# Altium schematic sheet ZYNQ_SOC_PWR.SchDoc
size A4
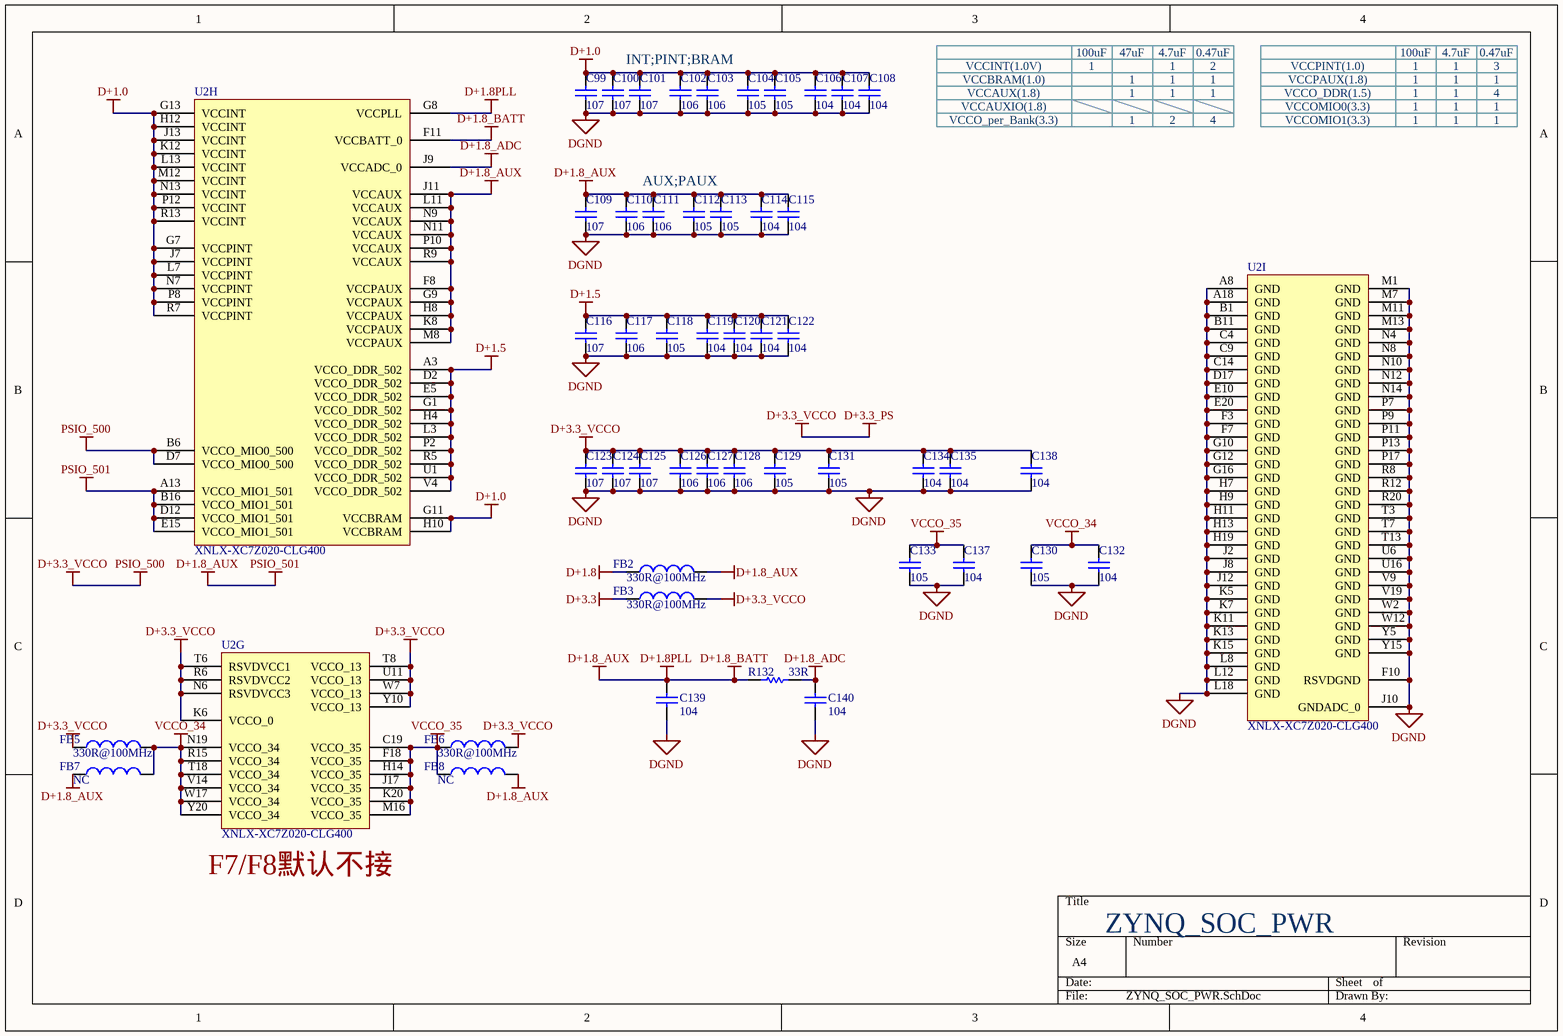
[diagram p0: ZYNQ_SOC_PWR.SchDoc]

## Parts
C99  107  [C 1206_L]
C100  107  [C 1206_L]
C101  107  [C 1206_L]
C102  106  [C 0603_L]
C103  106  [C 0603_L]
C104  105  [C 0402_LL]
C105  105  [C 0402_LL]
C106  104  [C 0402_LL]
C107  104  [C 0402_LL]
C108  104  [C 0402_LL]
C109  107  [C 1206_L]
C110  106  [C 0603_L]
C111  106  [C 0603_L]
C112  105  [C 0402_LL]
C113  105  [C 0402_LL]
C114  104  [C 0402_LL]
C115  104  [C 0402_LL]
C116  107  [C 1206_L]
C117  106  [C 0603_L]
C118  105  [C 0402_LL]
C119  104  [C 0402_LL]
C120  104  [C 0402_LL]
C121  104  [C 0402_LL]
C122  104  [C 0402_LL]
C123  107  [C 1206_L]
C124  107  [C 1206_L]
C125  107  [C 1206_L]
C126  106  [C 0603_L]
C127  106  [C 0603_L]
C128  106  [C 0603_L]
C129  105  [C 0402_LL]
C130  105  [C 0402_LL]
C131  105  [C 0402_LL]
C132  104  [C 0402_LL]
C133  105  [C 0402_LL]
C134  104  [C 0402_LL]
C135  104  [C 0402_LL]
C137  104  [C 0402_LL]
C138  104  [C 0402_LL]
C139  104  [C 0402_LL]
C140  104  [C 0402_LL]
FB2  value 330R@100MHz  [L 0805]  (hidden comment: Ferrite Bead)
FB3  value 330R@100MHz  [L 0805]  (hidden comment: Ferrite Bead)
FB5  value 330R@100MHz  [L 0805]  (hidden comment: Ferrite Bead)
FB6  value 330R@100MHz  [L 0805]  (hidden comment: Ferrite Bead)
FB7  value NC  [L 0805]  (hidden comment: Ferrite Bead)
FB8  value NC  [L 0805]  (hidden comment: Ferrite Bead)
R132  33R  [R 0402_L]
U2  XNLX-XC7Z020-CLG400  [BGA400]  (parts G,H,I of 9)

## Nets
D+1.0: C99.2 C100.2 C101.2 C102.2 C103.2 C104.2 C105.2 C106.2 C107.2 C108.2 U2.G7(VCCPINT) U2.G11(VCCBRAM) U2.G13(VCCINT) U2.H10(VCCBRAM) U2.H12(VCCINT) U2.J7(VCCPINT) U2.J13(VCCINT) U2.K12(VCCINT) U2.L7(VCCPINT) U2.L13(VCCINT) U2.M12(VCCINT) U2.N7(VCCPINT) U2.N13(VCCINT) U2.P8(VCCPINT) U2.P12(VCCINT) U2.R7(VCCPINT) U2.R13(VCCINT)
D+1.5: C116.2 C117.2 C118.2 C119.2 C120.2 C121.2 C122.2 U2.A3(VCCO_DDR_502) U2.D2(VCCO_DDR_502) U2.E5(VCCO_DDR_502) U2.G1(VCCO_DDR_502) U2.H4(VCCO_DDR_502) U2.L3(VCCO_DDR_502) U2.P2(VCCO_DDR_502) U2.R5(VCCO_DDR_502) U2.U1(VCCO_DDR_502) U2.V4(VCCO_DDR_502)
D+1.8: FB2.1
D+1.8_ADC: C140.2 R132.1 U2.J9(VCCADC_0)
D+1.8_AUX: C109.2 C110.2 C111.2 C112.2 C113.2 C114.2 C115.2 C139.2 FB2.2 FB7.1 FB8.2 R132.2 U2.A13(VCCO_MIO1_501) U2.B16(VCCO_MIO1_501) U2.D12(VCCO_MIO1_501) U2.E15(VCCO_MIO1_501) U2.F8(VCCPAUX) U2.F11(VCCBATT_0) U2.G8(VCCPLL) U2.G9(VCCPAUX) U2.H8(VCCPAUX) U2.J11(VCCAUX) U2.K8(VCCPAUX) U2.L11(VCCAUX) U2.M8(VCCPAUX) U2.N9(VCCAUX) U2.N11(VCCAUX) U2.P10(VCCAUX) U2.R9(VCCAUX)  [also labelled D+1.8_BATT, D+1.8PLL, PSIO_501]
D+3.3: FB3.1
D+3.3_PS: C123.2 C124.2 C125.2 C126.2 C127.2 C128.2 C129.2 C131.2 C134.2 C135.2 C138.2 FB3.2 FB5.1 FB6.2 U2.B6(VCCO_MIO0_500) U2.D7(VCCO_MIO0_500) U2.K6(VCCO_0) U2.N6(RSVDVCC3) U2.R6(RSVDVCC2) U2.T6(RSVDVCC1) U2.T8(VCCO_13) U2.U11(VCCO_13) U2.W7(VCCO_13) U2.Y10(VCCO_13)  [also labelled D+3.3_VCCO, PSIO_500]
DGND: C99.1 C100.1 C101.1 C102.1 C103.1 C104.1 C105.1 C106.1 C107.1 C108.1 C109.1 C110.1 C111.1 C112.1 C113.1 C114.1 C115.1 C116.1 C117.1 C118.1 C119.1 C120.1 C121.1 C122.1 C123.1 C124.1 C125.1 C126.1 C127.1 C128.1 C129.1 C130.1 C131.1 C132.1 C133.1 C134.1 C135.1 C137.1 C138.1 C139.1 C140.1 U2.A8(GND) U2.A18(GND) U2.B1(GND) U2.B11(GND) U2.C4(GND) U2.C9(GND) U2.C14(GND) U2.D17(GND) U2.E10(GND) U2.E20(GND) U2.F3(GND) U2.F7(GND) U2.F10(RSVDGND) U2.G10(GND) U2.G12(GND) U2.G16(GND) U2.H7(GND) U2.H9(GND) U2.H11(GND) U2.H13(GND) U2.H19(GND) U2.J2(GND) U2.J8(GND) U2.J10(GNDADC_0) U2.J12(GND) U2.K5(GND) U2.K7(GND) U2.K11(GND) U2.K13(GND) U2.K15(GND) U2.L8(GND) U2.L12(GND) U2.L18(GND) U2.M1(GND) U2.M7(GND) U2.M11(GND) U2.M13(GND) U2.N4(GND) U2.N8(GND) U2.N10(GND) U2.N12(GND) U2.N14(GND) U2.P7(GND) U2.P9(GND) U2.P11(GND) U2.P13(GND) U2.P17(GND) U2.R8(GND) U2.R12(GND) U2.R20(GND) U2.T3(GND) U2.T7(GND) U2.T13(GND) U2.U6(GND) U2.U16(GND) U2.V9(GND) U2.V19(GND) U2.W2(GND) U2.W12(GND) U2.Y5(GND) U2.Y15(GND)
VCCO_34: C130.2 C132.2 FB5.2 FB7.2 U2.N19(VCCO_34) U2.R15(VCCO_34) U2.T18(VCCO_34) U2.V14(VCCO_34) U2.W17(VCCO_34) U2.Y20(VCCO_34)
VCCO_35: C133.2 C137.2 FB6.1 FB8.1 U2.C19(VCCO_35) U2.F18(VCCO_35) U2.H14(VCCO_35) U2.J17(VCCO_35) U2.K20(VCCO_35) U2.M16(VCCO_35)

## Notes on the sheet
- INT;PINT;BRAM
- VCCINT(1.0V)
- VCCBRAM(1.0)
- VCCAUX(1.8)
- VCCAUXIO(1.8)
- VCCO_per_Bank(3.3)
- 100uF
- 1
- 47uF
- 4.7uF
- 2
- 0.47uF
- 4
- VCCPINT(1.0)
- VCCO_DDR(1.5)
- VCCPAUX(1.8)
- VCCOMIO0(3.3)
- VCCOMIO1(3.3)
- 3
- AUX;PAUX
- (near U2) F7/F8默认不接
- ZYNQ_SOC_PWR

## Library data of the parts
C99-C135 C137-C140 = Cap: Capacitor; Published: 8-Jun-2000; LatestRevisionDate: 17-Jul-2002; LatestRevisionNote: Re-released for DXP Platform.; PackageReference: RAD-0.3; Publisher: Altium Limited; PackageDescription: Radial Cap, Thru-Hole; 2 Leads; 0.3 in Pin Spacing
FB2 FB3 FB5-FB8 = Inductor: Code_IEC: 1005; Published: 8-Jun-2000; LatestRevisionDate: 29-May-2009; LatestRevisionNote: IPC-7351 Footprint Added.; PackageReference: 0402-A; Publisher: Altium Limited; PackageDescription: Chip Inductor; Code_JEITA: 0402
R132 = Res1: Resistor; Value: 1K; Published: 8-Jun-2000; LatestRevisionDate: 17-Jul-2002; LatestRevisionNote: Re-released for DXP Platform.; PackageReference: AXIAL-0.3; Publisher: Altium Limited; PackageDescription: Axial Device, Thru-Hole; 2 Leads; 0.3 in Pin Spacing
U2 = XNLX-XC7Z020-CLG400: xilinx双核A9处理器与FPGA集成的SoC; Manufacturer: xilinx; value: NC